# EAGLE schematic raspo_1_0 (EAGLE 7.2.0)
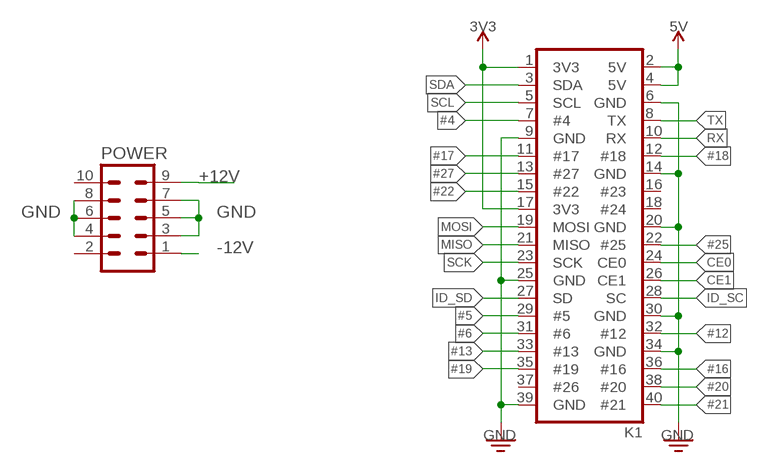
[diagram p0: schematic, sheet 1]

## Parts
K1  2X20-RPI  [2X20-RPI]
POWER  10_PIN_HEADER  [MA05-2]

## Nets
3V3: K1.1(3V3) K1.17(3V3)
5V: K1.2(5V) K1.4(5V)
#4: K1.7(#4)
#5: K1.29(#5)
#6: K1.31(#6)
#12: K1.32(#12)
#13: K1.33(#13)
#16: K1.36(#16)
#17: K1.11(#17)
#18: K1.12(#18)
#19: K1.35(#19)
#20: K1.38(#20)
#21: K1.40(#21)
#22: K1.15(#22)
#25: K1.22(#25)
#27: K1.13(#27)
+12V: POWER.9
-12V [power]: POWER.1
CE0: K1.24(CE0)
CE1: K1.26(CE1)
GND: K1.6(GND) K1.9(GND) K1.14(GND) K1.20(GND) K1.25(GND) K1.30(GND) K1.34(GND) K1.39(GND) POWER.3 POWER.4 POWER.5 POWER.6 POWER.7 POWER.8
ID_SC: K1.28(SC)
ID_SD: K1.27(SD)
MISO: K1.21(MISO)
MOSI: K1.19(MOSI)
RX: K1.10(RX)
SCK: K1.23(SCK)
SCL: K1.5(SCL)
SDA: K1.3(SDA)
TX: K1.8(TX)
Unconnected: K1.16(#23) K1.18(#24) K1.37(#26) POWER.2 POWER.10

## Library data of the parts
K1 = Ai_Connectors:2X20-RPI
POWER = TomW:10_PIN_HEADER: PIN HEADER; OC_FARNELL: unknown; OC_MOUSER: 571-5-146258-5; OC_NEWARK: unknown

## Net classes
0 default: width 0.254 mm
1 power: width 0.61 mm